# EAGLE design janaury20 (EAGLE 7.3.0)
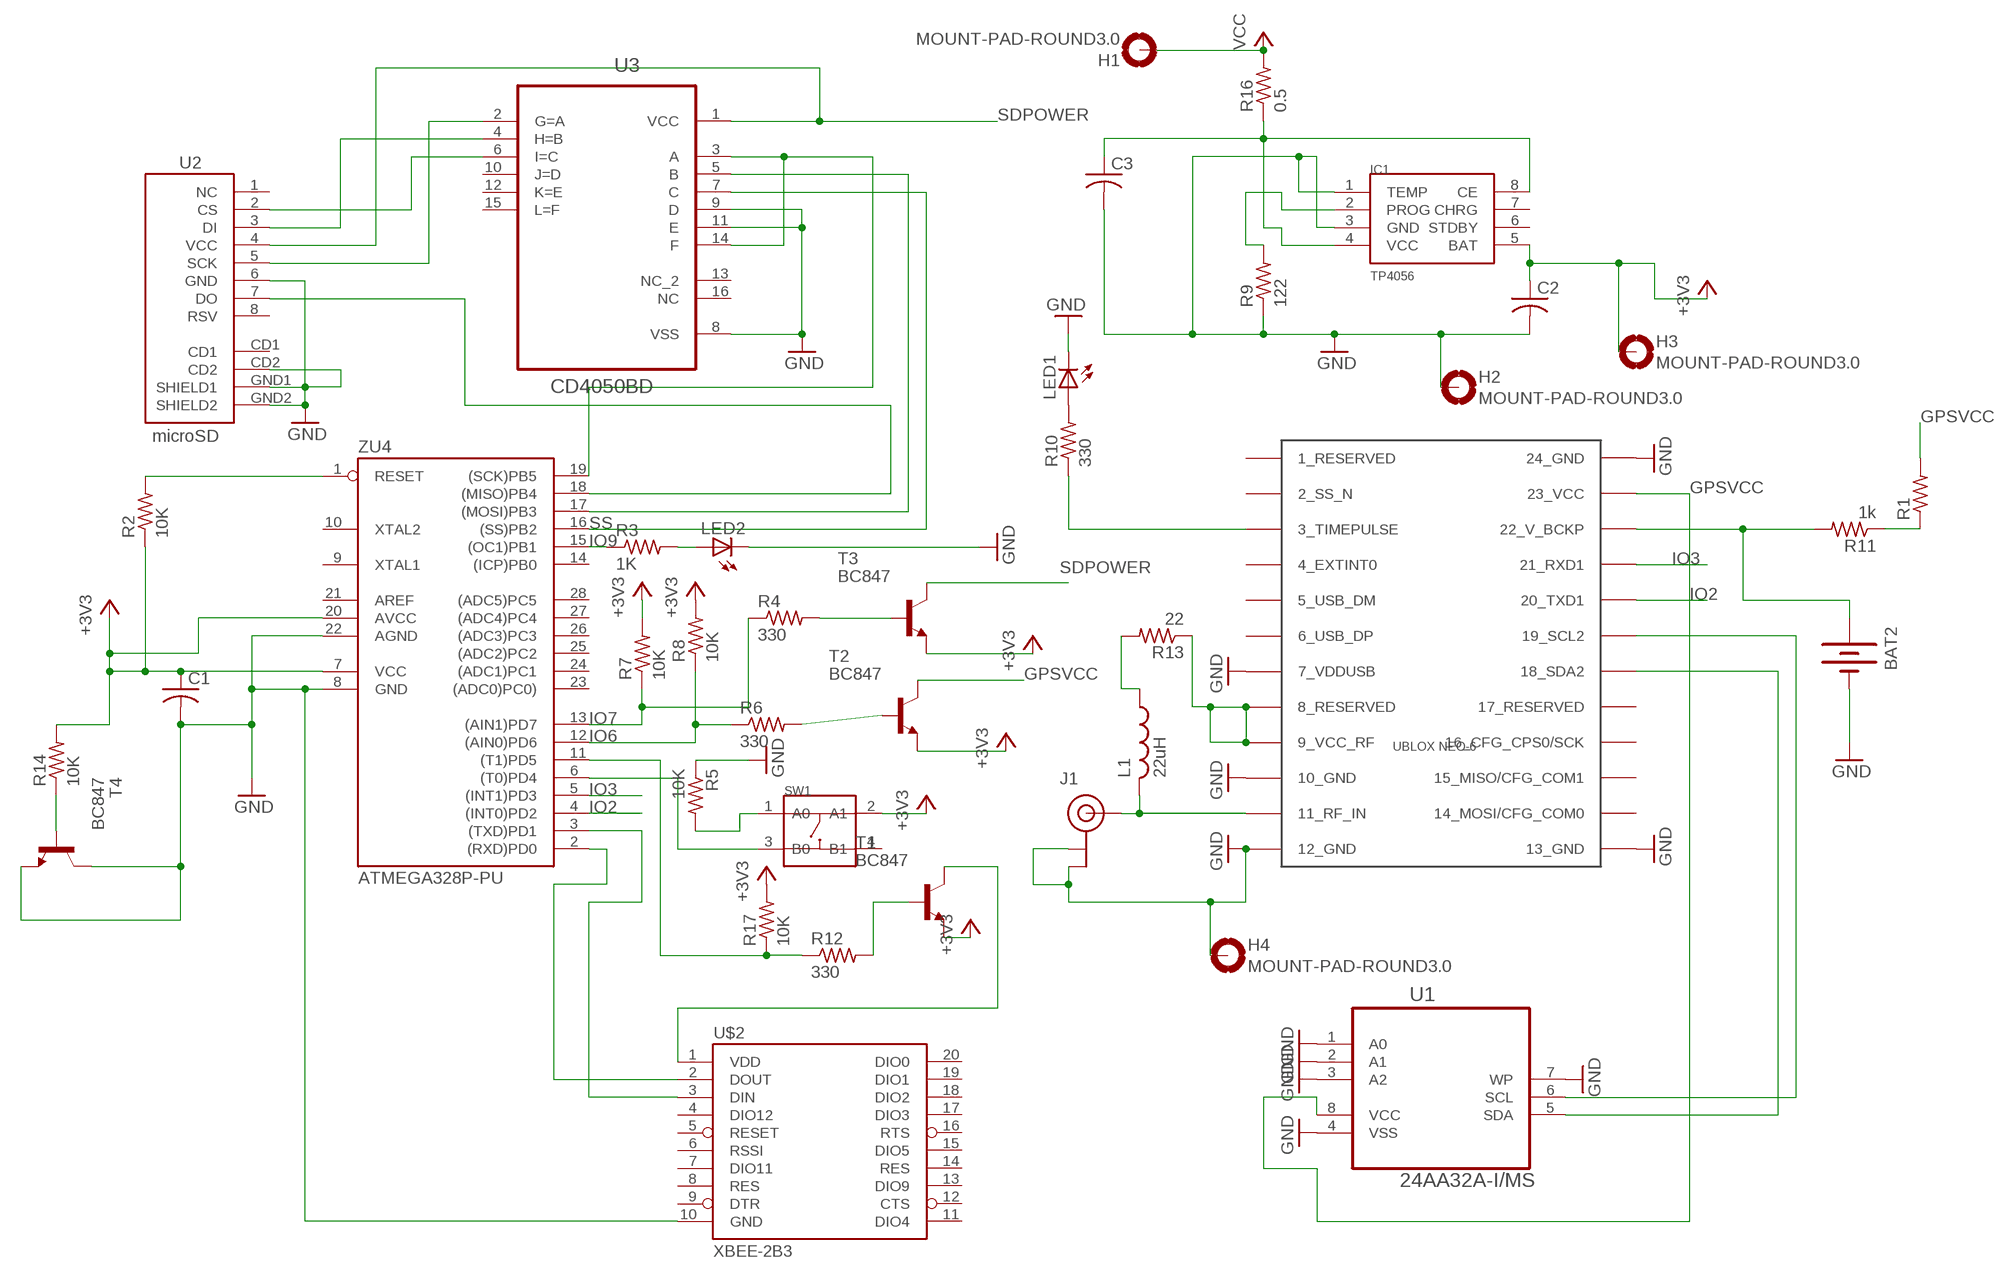
[diagram p0: schematic, sheet 1]

## Parts
BAT2  BATTERY12PTH  [BATTCON_12MM_PTH]
C1  C-USC1608  [C1608]
C2  C-USC2012  [C2012]
C3  C-USC2012  [C2012]
H1  MOUNT-PAD-ROUND3.0  [3,0-PAD]
H2  MOUNT-PAD-ROUND3.0  [3,0-PAD]
H3  MOUNT-PAD-ROUND3.0  [3,0-PAD]
H4  MOUNT-PAD-ROUND3.0  [3,0-PAD]
IC1  TP4056  [SOP-8]
J1  U.FL  [U.FL]
L1  22uH  L-USL2012C  [L2012C]
LED1  LEDSMT1206  [1206]
LED2  LEDSMT1206  [1206]
R1  R-US_R0805  [R0805]
R2  10K  R-US_M3216  [M3216]
R3  1K  R-US_M3216  [M3216]
R4  330  R-US_M3216  [M3216]
R5  10K  R-US_M3216  [M3216]
R6  330  R-US_M3216  [M3216]
R7  10K  R-US_M3216  [M3216]
R8  10K  R-US_M3216  [M3216]
R9  122  R-US_M3216  [M3216]
R10  330  R-US_M3216  [M3216]
R11  1k  R-US_M3216  [M3216]
R12  330  R-US_M3216  [M3216]
R13  22  R-US_M3216  [M3216]
R14  10K  R-US_M3216  [M3216]
R16  0.5  R-US_M2012  [M2012]
R17  10K  R-US_M3216  [M3216]
SW1  SMD-BUTTON(4P-5.2X5.2X1.5MM-SKQGAKE010)-SKQGAKE010  [SW4-SMD-5.2X5.2X1.5MM]
T1  BC847  [SOT23]
T2  BC847  [SOT23]
T3  BC847  [SOT23]
T4  BC847  [SOT23]
U1  24AA32A-I/MS  [SOP65P490X110-8N]
U2  microSD  USD-SOCKETSMD  [MICRO-SD-SOCKET-PP]
U3  CD4050BD  [SOIC127P600X175-16N]
U$1  UBLOX_NEO-6  [UBLOX_NEO-6P]
U$2  XBEE-2B3  [XBEE-SMD]
ZU4  ATMEGA328P-PU  [DIL28-3]

## Nets
+3V3 [usbvcc]: C1.1 C2.1 H3.B3,0(MOUNT) IC1.5(BAT) R2.1 R7.2 R8.2 R14.2 R17.2 SW1.2(A1) T1.2(E) T2.2(E) T3.2(E) ZU4.7(VCC) ZU4.20(AVCC)
CS: U2.2(CS) U3.6(I=C)
GND [gnd]: BAT2.GND(-) C1.2 C2.2 C3.2 H2.B3,0(MOUNT) H4.B3,0(MOUNT) IC1.1(TEMP) IC1.3(GND) J1.P$1(GND) J1.P$2(GND) LED1.C LED2.C R5.1 R9.1 T4.2(E) T4.3(C) U1.1(A0) U1.2(A1) U1.3(A2) U1.4(VSS) U1.7(WP) U2.6(GND) U2.CD2 U2.GND1(SHIELD1) U2.GND2(SHIELD2) U3.8(VSS) U3.9(D) U3.11(E) U$1.7_VDDUSB U$1.10_GND U$1.12_GND U$1.13_GND U$1.24_GND U$2.10(GND) ZU4.8(GND) ZU4.22(AGND)
GPSVCC: R1.2 T2.3(C) U1.8(VCC) U$1.23_VCC
IO2: U$1.20_TXD1 ZU4.4((INT0)PD2)
IO3: U$1.21_RXD1 ZU4.5((INT1)PD3)
IO6: R6.1 R8.1 ZU4.12((AIN0)PD6)
IO7: R4.1 R7.1 ZU4.13((AIN1)PD7)
IO9: R3.1 ZU4.15((OC1)PB1)
MOSI: U3.5(B) ZU4.17((MOSI)PB3)
N$1: U2.7(DO) ZU4.18((MISO)PB4)
N$2: LED2.A R3.2
N$3: LED1.A R10.2
N$4: R5.2 SW1.1(A0)
N$5: SW1.3(B0) ZU4.6((T0)PD4)
N$6: R4.2 T3.1(B)
N$7: R6.2 T2.1(B)
N$8: U1.6(SCL) U$1.19_SCL2
N$9: R12.1 R17.1 ZU4.11((T1)PD5)
N$10: L1.1 R13.2
N$11: U2.3(DI) U3.4(H=B)
N$12: R12.2 T1.1(B)
N$13: R13.1 U$1.8_RESERVED U$1.9_VCC_RF
N$14: R14.1 T4.1(B)
N$15: J1.P$3(SIGNAL) L1.2 U$1.11_RF_IN
N$18: BAT2.VCC@1(+) R11.2 U$1.22_V_BCKP
N$19: U1.5(SDA) U$1.18_SDA2
N$20: R1.1 R11.1
N$21: IC1.2(PROG) R9.2
N$23: U$2.2(DOUT) ZU4.2((RXD)PD0)
N$25: U$2.3(DIN) ZU4.3((TXD)PD1)
N$27: C3.1 IC1.4(VCC) IC1.8(CE) R16.1
N$28: T1.3(C) U$2.1(VDD)
RESET: R2.2 ZU4.1(RESET)
SCK: U3.3(A) U3.14(F) ZU4.19((SCK)PB5)
SCK1: U2.5(SCK) U3.2(G=A)
SCK2: R10.1 U$1.3_TIMEPULSE
SDPOWER: T3.3(C) U2.4(VCC) U3.1(VCC)
SS: U3.7(C) ZU4.16((SS)PB2)
VCC: H1.B3,0(MOUNT) R16.2
Unconnected: IC1.6(STDBY) IC1.7(CHRG) SW1.4(B1) U2.1(NC) U2.8(RSV) U2.CD1 U3.10(J=D) U3.12(K=E) U3.13(NC_2) U3.15(L=F) U3.16(NC) U$1.1_RESERVED U$1.2_SS_N U$1.4_EXTINT0 U$1.5_USB_DM U$1.6_USB_DP U$1.14_MOSI/CFG_COM0 U$1.15_MISO/CFG_COM1 U$1.16_CFG_CPS0/SCK U$1.17_RESERVED U$2.4(DIO12) U$2.5(RESET) U$2.6(RSSI) U$2.7(DIO11) U$2.8(RES) U$2.9(DTR) U$2.11(DIO4) U$2.12(CTS) U$2.13(DIO9) U$2.14(RES) U$2.15(DIO5) U$2.16(RTS) U$2.17(DIO3) U$2.18(DIO2) U$2.19(DIO1) U$2.20(DIO0) ZU4.9(XTAL1) ZU4.10(XTAL2) ZU4.14((ICP)PB0) ZU4.21(AREF) ZU4.23((ADC0)PC0)) ZU4.24((ADC1)PC1) ZU4.25((ADC2)PC2) ZU4.26((ADC3)PC3) ZU4.27((ADC4)PC4) ZU4.28((ADC5)PC5)

## Library data of the parts
BAT2 = SparkFun-Electromechanical:BATTERY: Battery Holders Various common sizes : AA, AAA, 18650 (PRT-12895), 20mm coin cell and 12mm coin cell. 20MM_4LEGS, BATT-10373; PROD_ID: BATT-08315
C1-C3 = resistor:C-US: CAPACITOR, American symbol
H1-H4 = holes:MOUNT-PAD-ROUND: MOUNTING PAD, round
IC1 = TP4056:TP4056
J1 = SparkFun-Connectors:U.FL: SMD antenna connector- WRL-09144; PROD_ID: CONN-09193
L1 = resistor:L-US: INDUCTOR, American symbol
LED1 LED2 = led:LED: LED OSRAM: - CHIPLED LG R971, LG N971, LY N971, LG Q971, LY Q971, LO R971, LY R971 LH N974, LH R974 LS Q976, LO Q976, LY Q976 LO Q996 - Hyper CHIPLED LW Q18S LB Q993, LB Q99A, LB R99A - SideLED LS A670, LO A670, LY A670, LG A670, LP A670 LB A673, LV A673, LT A673, LW A673 LH A674 LY A675 LS A676, LA A676, LO A676, LY A676, LW A676 LS A679, LY A679, LG A679 - Hyper Micro SIDELED® LS Y876, LA Y876, LO Y876, LY Y876 LT Y87S - SmartLED LW L88C, LW L88S LB L89C, LB L89S, LG L890 LS L89K, LO L89K, LY L89K LS L896, LA L896, LO L896, LY L896 - TOPLED LS T670, LO T670, LY T670, LG T670, LP T670 LSG T670, LSP T670, LSY T670, LOP T670, LYG T670 LG T671, LOG T671, LSG T671 LB T673, LV T673, LT T673, LW T673 LH T674 LS T676, LA T676, LO T676, LY T676, LB T676, LH T676, LSB T676, LW T676 LB T67C, LV T67C, LT T67C, LS T67K, LO T67K, LY T67K, LW E67C LS E67B, LA E67B, LO E67B, LY E67B, LB E67C, LV E67C, LT E67C LW T67C LS T679, LY T679, LG T679 LS T770, LO T770, LY T770, LG T770, LP T770 LB T773, LV T773, LT T773, LW T773 LH T774 LS E675, LA E675, LY E675, LS T675 LS T776, LA T776, LO T776, LY T776, LB T776 LHGB T686 LT T68C, LB T68C - Hyper Mini TOPLED® LB M676 - Mini TOPLED Santana® LG M470 LS M47K, LO M47K, LY M47K Source: http://www.osram.convergy.de LUXEON: - LUMILED® LXK2-PW12-R00, LXK2-PW12-S00, LXK2-PW14-U00, LXK2-PW14-V00 LXK2-PM12-R00, LXK2-PM12-S00, LXK2-PM14-U00 LXK2-PE12-Q00, LXK2-PE12-R00, LXK2-PE12-S00, LXK2-PE14-T00, LXK2-PE14-U00 LXK2-PB12-K00, LXK2-PB12-L00, LXK2-PB12-M00, LXK2-PB14-N00, LXK2-PB14-P00, LXK2-PB14-Q00 LXK2-PR12-L00, LXK2-PR12-M00, LXK2-PR14-Q00, LXK2-PR14-R00 LXK2-PD12-Q00, LXK2-PD12-R00, LXK2-PD12-S00 LXK2-PH12-R00, LXK2-PH12-S00 LXK2-PL12-P00, LXK2-PL12-Q00, LXK2-PL12-R00 Source: www.luxeon.com KINGBRIGHT: KA-3528ASYC Source: www.kingbright.com
R1-R14 R16 R17 = resistor:R-US_: RESISTOR, American symbol
SW1 = Seeed-OPL-Switch:SMD-BUTTON(4P-5.2X5.2X1.5MM-SKQGAKE010): 311020067
T1-T4 = transistor:BC847: NPN TRANSISTOR
U1 = Microchip_By_element14_Batch_2:24AA32A-I/MS: IC EEPROM 32KBIT 400KHZ; MPN: 24AA32A-I/MS; OC_FARNELL: 1331296; OC_NEWARK: 40C2562; PACKAGE: MSOP8; SUPPLIER: Microchip
U2 = SparkFun:USD-SOCKET: microSD Socket Push-push type uSD socket. Schematic element and footprint production proven. Spark Fun Electronics SKU : PRT-00127. tDoc lines correctly indicate media card edge positions when inserting (unlocked, locked, depressed).
U3 = Texas Instruments_By_element14_Batch_1:CD4050BD: CMOS Hex Buffer/Converters; MPN: CD4050BD; OC_FARNELL: 1740857; OC_NEWARK: 50R5062; PACKAGE: 16-SOIC; SUPPLIER: Texas Instruments
U$1 = Ava:UBLOX_NEO-6: UBLOX NEO-6 GPS MODULE Author Anthony Stirk / http://ava.upuaut.net http://www.u-blox.com/images/downloads/Product_Docs/LEA-6_NEO-6_MAX_HardwareIntegrationManual_%28GPS.G6-HW-09007%29.pdf http://www.u-blox.com/images/downloads/Product_Docs/NEO-6_DataSheet_%28GPS.G6-HW-09005%29.pdf
U$2 = SparkFun-RF:XBEE-2: Xbee module footprints SMT header is CONN-09042.; PROD_ID: CONN-09042
ZU4 = SmartPrj:ATMEGA328P-: MICROCONTROLLER 4 Kbytes FLASH 128 bytes SRAM 256 bytes EEPROM UART 6-channel 10 bit ADC

## Net classes
2 gnd: width 0.305 mm, drill 0.559 mm, clearance 0.254 mm
3 usbvcc: width 0.508 mm, drill 0.61 mm, clearance 0.254 mm

## Board
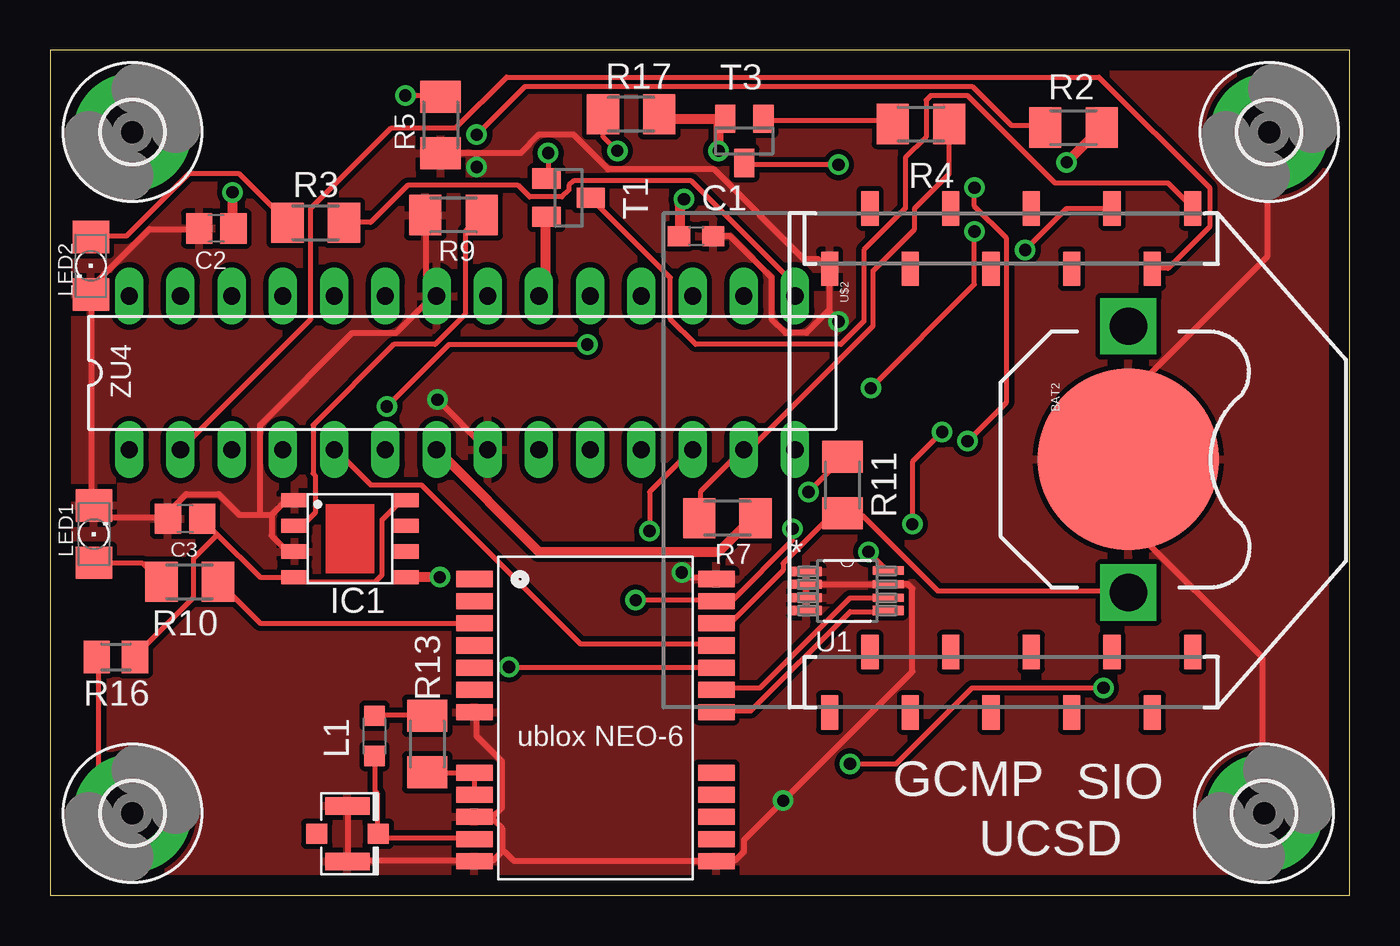
[diagram p1: board, top side]
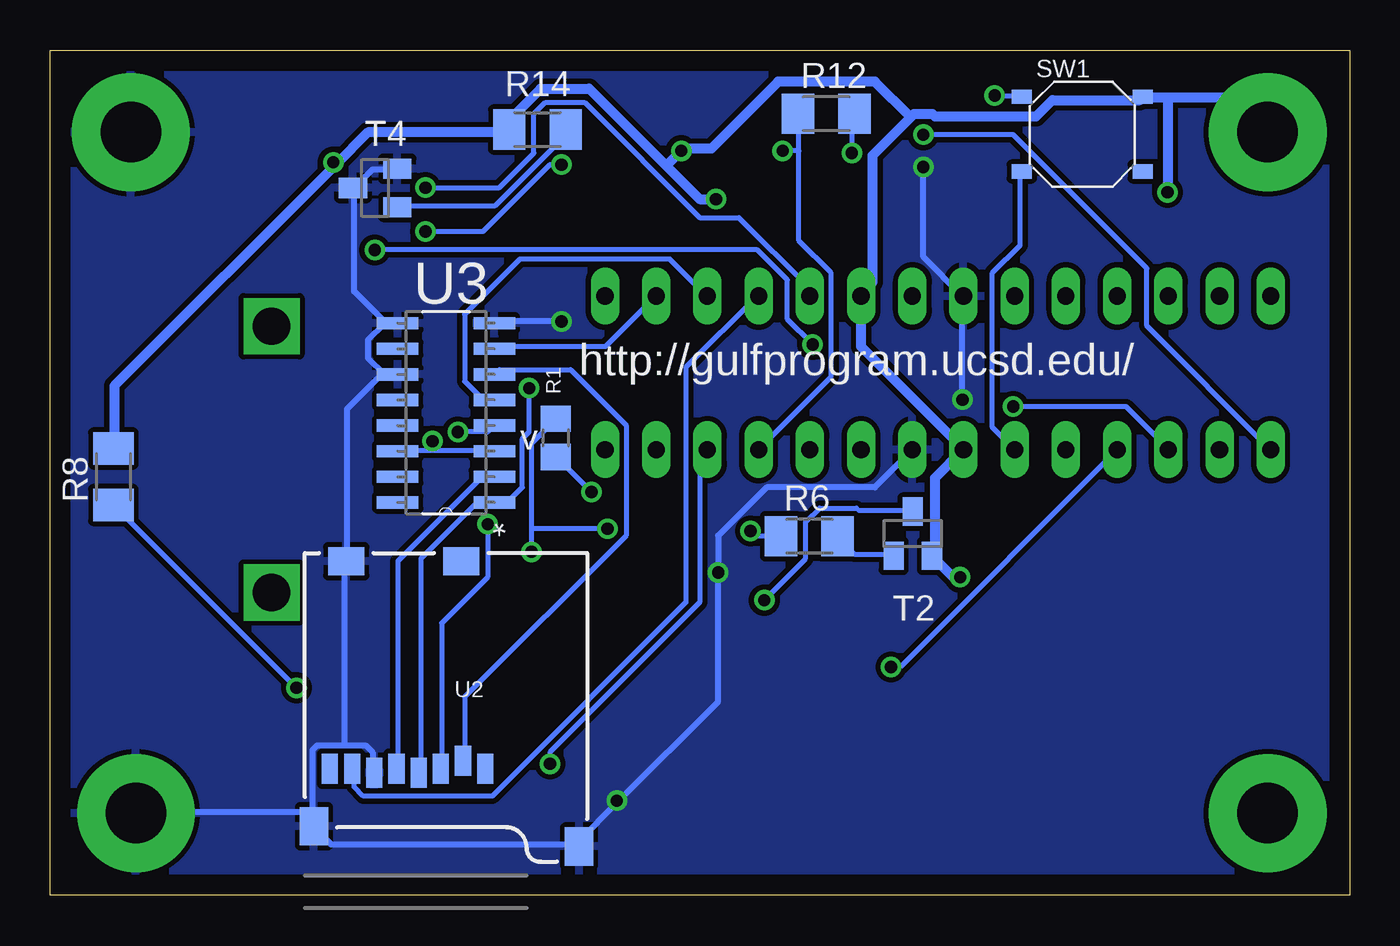
[diagram p2: board, bottom side, seen from below]

Size 64.44 x 41.9 mm. Coordinates in mm from the lower left corner, seen from the top.
Outline: 0,0 64.44,0 64.44,41.9 0,41.9 0,0
Copper layers (1*16): Top 0.035mm / dielectric 1.5mm / Bottom 0.035mm
Design rules "default": minimum track width 10mil, minimum drill 24mil, track to track 8mil, track to pad 8mil, pad to pad 8mil, via to via 8mil, smd to smd 8mil, copper to edge 40mil, drill to drill 8mil, minimum pad ring 10mil, minimum via ring 8mil, stop-mask expansion 4mil, vias tented up to drill 0mil, thermal gap 10mil

### Footprints (pad centres in the part's own frame; a part is rotated, then mirrored left to right if it is on the bottom)
BATTCON_12MM_PTH = smd 9 x 9: GND 0,0 | drill 1.854 square: VCC@1 6.604,0; VCC@2 -6.604,0
C1608 = smd 1.1 x 1: 1 -0.85,0; 2 0.85,0
C2012 = smd 1.3 x 1.5: 1 -0.85,0; 2 0.85,0
3,0-PAD = drill 3 pad 5.842: B3,0 0,0
SOP-8 = smd 1.3 x 0.7: 1 -2.75,1.905; 2 -2.75,0.635; 3 -2.75,-0.635; 4 -2.75,-1.905; 5 2.75,-1.905; 6 2.75,-0.635; 7 2.75,0.635; 8 2.75,1.905
U.FL = smd 2.2 x 0.85: P$1 0,1.375; P$2 0,-1.375 | smd 1.05 x 1: P$3 1.525,0; P$4 -1.525,0
L2012C = smd 1 x 1: 1 -1,0; 2 1,0
1206 = smd 1.6 x 1.803: A -1.422,0; C 1.422,0
R0805 = smd 1.3 x 1.5: 1 -0.95,0; 2 0.95,0
M3216 = smd 1.6 x 2: 1 -1.4,0; 2 1.4,0
M2012 = smd 1.3 x 1.6: 1 -0.95,0; 2 0.95,0
SW4-SMD-5.2X5.2X1.5MM = smd 1 x 0.7: 1 -3,1.85; 2 3,1.85; 3 -3,-1.85; 4 3,-1.85
SOT23 = smd 1 x 1.4: 1 -0.95,-1.1; 2 0.95,-1.1; 3 0,1.1
SOP65P490X110-8N = smd 1.524 x 0.457: 1 -2.032,0.965; 2 -2.032,0.33; 3 -2.032,-0.33; 4 -2.032,-0.965; 5 2.032,-0.965 | smd 1.524 x 0.406: 6 2.032,-0.33; 7 2.032,0.33; 8 2.032,1.016
MICRO-SD-SOCKET-PP = smd 0.8 x 1.5: 1 -8.94,10.7; 2 -7.84,10.3; 3 -6.74,10.7; 4 -5.64,10.9; 5 -4.54,10.7; 6 -3.44,10.9; 7 -2.34,10.7; 8 -1.24,10.7 | smd 1.8 x 1.4: CD1 -7.75,0.4; CD2 -2.05,0.4 | smd 1.4 x 1.9: GND1 -13.6,14.55; GND2 -0.45,13.55
SOIC127P600X175-16N = smd 2.057 x 0.61: 1 -4.801,8.89; 2 -4.801,7.62; 3 -4.801,6.35; 4 -4.801,5.08; 5 -4.801,3.81; 6 -4.801,2.54; 7 -4.801,1.27; 8 -4.801,0; 9 0,0; 10 0,1.27; 11 0,2.54; 12 0,3.81; 13 0,5.08; 14 0,6.35; 15 0,7.62; 16 0,8.89
UBLOX_NEO-6P = smd 1.8 x 0.8: 1_RESERVED 6.4,-7.4; 2_SS_N 6.4,-6.3; 3_TIMEPULSE 6.4,-5.2; 4_EXTINT0 6.4,-4.1; 5_USB_DM 6.4,-3; 6_USB_DP 6.4,-1.9; 7_VDDUSB 6.4,-0.8; 8_RESERVED 6.4,2.2; 9_VCC_RF 6.4,3.3; 10_GND 6.4,4.4; 11_RF_IN 6.4,5.5; 12_GND 6.4,6.6; 13_GND -5.6,6.6; 14_MOSI/CFG_COM0 -5.6,5.5; 15_MISO/CFG_COM1 -5.6,4.4; 16_CFG_CPS0/SCK -5.6,3.3; 17_RESERVED -5.6,2.2; 18_SDA2 -5.6,-0.8; 19_SCL2 -5.6,-1.9; 20_TXD1 -5.6,-3; 21_RXD1 -5.6,-4.1; 22_V_BCKP -5.6,-5.2; 23_VCC -5.6,-6.3; 24_GND -5.6,-7.4
XBEE-SMD = smd 1.7 x 0.85: 1 -12.5,20; 2 -9.5,18; 3 -12.5,16; 4 -9.5,14; 5 -12.5,12; 6 -9.5,10; 7 -12.5,8; 8 -9.5,6; 9 -12.5,4; 10 -9.5,2; 11 12.5,2; 12 9.5,4; 13 12.5,6; 14 9.5,8; 15 12.5,10; 16 9.5,12; 17 12.5,14; 18 9.5,16; 19 12.5,18; 20 9.5,20
DIL28-3 = drill 0.85 pad 1.422 long: 1 -16.51,-3.81; 2 -13.97,-3.81; 3 -11.43,-3.81; 4 -8.89,-3.81; 5 -6.35,-3.81; 6 -3.81,-3.81; 7 -1.27,-3.81; 8 1.27,-3.81; 9 3.81,-3.81; 10 6.35,-3.81; 11 8.89,-3.81; 12 11.43,-3.81; 13 13.97,-3.81; 14 16.51,-3.81; 15 16.51,3.81; 16 13.97,3.81; 17 11.43,3.81; 18 8.89,3.81; 19 6.35,3.81; 20 3.81,3.81; 21 1.27,3.81; 22 -1.27,3.81; 23 -3.81,3.81; 24 -6.35,3.81; 25 -8.89,3.81; 26 -11.43,3.81; 27 -13.97,3.81; 28 -16.51,3.81

### Placement (x,y rotation side)
BAT2  53.47,21.62 270 top
C1  32.03,32.69 0 top
C2  8.23,33.07 180 top
C3  6.68,18.67 180 top
H1  4.06,4.06 0 top
H2  60.2,4.06 0 top
H3  4.06,37.85 0 top
H4  60.45,37.85 0 top
IC1  14.86,17.68 0 top
J1  14.73,3.05 0 top
L1  16.08,7.9 270 top
LED1  2.16,17.91 90 top
LED2  2.01,31.22 270 top
R1  39.37,22.68 90 bottom
R2  50.75,38.07 180 top
R3  13.16,33.35 180 top
R4  43.18,38.25 180 top
R5  19.35,38.2 90 top
R6  26.8,17.81 0 bottom
R7  33.58,18.69 0 top
R8  61.32,20.75 90 bottom
R9  19.99,33.73 0 top
R10  6.91,15.54 180 top
R11  39.29,20.35 270 top
R12  25.96,38.76 0 bottom
R13  18.69,7.49 90 top
R14  40.28,37.97 180 bottom
R16  3.25,11.81 180 top
R17  28.8,38.73 0 top
SW1  13.26,37.74 0 bottom
T1  25.7,34.59 270 top
T2  21.67,17.93 0 bottom
T3  34.42,37.41 180 top
T4  48.34,35.08 90 bottom
U1  39.52,15.09 0 top
U2  51.82,16.97 180 bottom
U3  47.22,28.37 180 bottom
U$1  27.43,8.28 180 top
U$2  36.65,21.56 270 top
ZU4  20.42,25.91 0 top

### Tracks (layer width: path | path; a pad name or v marks a point on that pad's centre or on a via)
+3V3  (via drill 0.61)
  Top 0.508: R17.2 30.29,38.63 30.4,38.52 33.38,38.52 T3.2 33.15,38.29 v33.15,36.92 | v31.43,34.52 31.2,34.29 31.2,32.69 C1.1 | v50.41,36.35 52.12,38.06 R2.1 | v9.03,34.86 9.03,33.15 C2.1 | ZU4.20 24.57,30.06 24.57,33.6 T1.2 | v19.32,15.77 IC1.5 | R7.2 34.98,18.63 34.75,18.63 33.15,17.03 24.23,17.03 19.2,22.06 ZU4.7
  Bottom 0.508: v31.43,34.52 32.23,34.52 33.89,36.18 | 33.89,36.18 37.72,40.01 40.12,40.01 41.6,38.52 41.6,38.06 R14.2 41.83,37.83 48.69,37.83 50.29,36.23 | 50.29,36.23 61.27,25.26 61.27,22.17 R8.2 | v50.41,36.35 50.29,36.23 | 33.89,36.18 v33.15,36.92 32.92,37.03 31.66,37.03 28.35,40.35 23.55,40.35 21.77,38.58 | 9.03,39.55 5.71,39.55 4.12,37.95 H3.B3,0 | 9.03,39.55 10.17,39.55 SW1.2 10.4,39.43 14.74,39.43 15.54,38.63 20.57,38.63 20.69,38.75 21.6,38.75 21.77,38.58 | 9.03,39.55 v9.03,34.86 | v19.32,15.77 19.66,15.77 20.69,16.8 T2.2 20.57,17.03 20.57,20.69 19.2,22.06 ZU4.7 19.32,22.29 24.23,27.2 ZU4.20 24.12,29.95 23.66,30.4 23.66,36.69 21.77,38.58
CS
  Bottom 0.254: U2.2 43.89,6.74 43.89,9.83 35.89,17.83 35.89,23.32 38.63,26.06 42.18,26.06 42.41,25.83 U3.6
GND  (via drill 0.61)
  Top 0.305: C1.2 33.72,32.69 35.78,30.63 35.78,28.57 36.46,27.89 37.49,27.89 38.58,28.98 | 38.58,28.98 38.63,29.03 38.63,30.98 U$2.10 38.52,31.09 38.06,31.55 37.38,31.55 32.92,36.01 27.66,36.01 25.95,37.72 24.23,37.72 23.32,36.8 21.14,36.8 | 21.14,36.8 19.43,36.8 R5.1 | 38.58,28.98 v39.09,28.46 | C2.2 7.32,33.03 4.92,33.03 2.06,30.18 2.06,29.83 LED2.C 2.06,29.72 2.06,19.43 LED1.C 2.17,19.32 2.74,18.75 5.83,18.75 C3.2 5.71,18.86 6.74,19.89 8.34,19.89 9.37,18.86 10.4,18.86 | R9.1 18.63,33.72 18.63,30.18 19.09,29.72 ZU4.22 18.97,29.72 17.14,27.89 14.97,27.89 10.4,23.32 10.4,18.86 | 10.97,18.86 10.97,17.83 11.66,17.14 12,17.14 IC1.3 | 10.97,18.86 11.66,19.55 12,19.55 IC1.1 | 10.4,18.86 10.97,18.86 | v21.14,36.12 21.14,36.8 | H4.B3,0 60.35,37.83 60.35,31.66 53.49,24.8 53.49,21.72 BAT2.GND 53.49,21.49 53.49,18.4 60.12,11.77 60.12,4.12 H2.B3,0 | U1.4 U1.3 U1.2 | U1.2 U1.1 | U1.2 37.6,15.43 41.49,15.43 U1.7 41.6,15.43 42.52,15.43 42.75,15.2 42.75,11.09 v36.35,4.69 34.4,2.74 34.4,2.17 33.95,1.71 33.15,1.71 U$1.13_GND 32.92,1.71 22.97,1.71 22.52,2.17 22.4,2.17 | J1.P$1 14.74,4.34 14.74,1.71 J1.P$2 14.86,1.71 20.92,1.71 U$1.12_GND 21.14,1.71 21.95,1.71 22.4,2.17 | 22.4,2.17 22.4,3.31 21.95,3.77 | 21.95,3.77 21.14,3.77 U$1.10_GND | U$1.7_VDDUSB 21.14,9.03 21.14,7.89 22.4,6.63 22.4,4.34 21.95,3.89 21.95,3.77 | v31.32,16 31.55,15.77 32.92,15.77 U$1.24_GND | v19.2,24.57 21.6,22.17 ZU4.8
  Bottom 0.305: v39.09,28.46 42.41,28.46 U3.8 | v21.14,36.12 21.14,31.66 19.2,29.72 ZU4.22 19.2,29.6 v19.2,24.57 | ZU4.8 21.72,22.06 23.55,20.23 28.92,20.23 31.32,17.83 v31.32,16 31.32,9.6 36.29,4.63 | T4.2 47.32,36.01 48.46,36.01 49.38,35.09 T4.3 49.38,34.98 49.38,29.95 47.89,28.46 U3.9 47.32,28.35 47.89,28.35 48.69,27.55 48.69,26.63 47.89,25.83 U3.11 48.01,25.83 49.72,24.12 49.72,16.69 U2.CD2 49.84,16.46 49.84,7.43 | 49.84,7.43 51.21,7.43 51.44,7.2 51.44,3.43 U2.GND2 | 49.84,7.43 48.81,7.43 48.46,7.09 48.46,6.17 U2.6 | U2.GND2 51.32,3.31 50.52,2.52 38.29,2.52 U2.GND1 38.29,2.63 36.29,4.63 | H2.B3,0 60.12,4.12 51.55,4.12 U2.GND2 | v36.35,4.69 36.29,4.63
  pour Top: 0,41.91 64.77,41.91 64.77,0 0,0
  pour Bottom: 0,41.91 64.77,41.91 64.77,0 0,0 0,1.27
GPSVCC  (via drill 0.61)
  Top 0.254: v40.58,17.03 41.49,16.12 U1.8 | v29.03,14.63 32.92,14.63 U$1.23_VCC 33.15,14.63 33.83,14.63 36.8,17.6 v36.8,18.17
  Bottom 0.254: v40.58,17.03 40.58,18.17 | 40.58,18.17 40.58,22.4 39.43,23.55 R1.2 | v29.03,14.63 26.98,16.69 26.98,18.52 26.29,19.2 24.46,19.2 24.35,19.09 21.72,19.09 T2.3 | v36.8,18.17 40.58,18.17
IO2  (via drill 0.61)
  Top 0.254: v22.75,11.32 32.92,11.32 U$1.20_TXD1
  Bottom 0.254: v22.75,11.32 22.29,11.32 11.54,22.06 ZU4.4
IO3
  Top 0.254: U$1.21_RXD1 32.92,12.46 26.29,12.46 18.4,20.34 15.89,20.34 14.17,22.06 ZU4.5
IO6  (via drill 0.61)
  Top 0.254: v29.72,18.06 29.72,20 31.77,22.06 ZU4.12 | v52.23,10.29 45.72,10.29 41.95,6.51 v39.66,6.51
  Bottom 0.254: v29.72,18.06 29.49,17.83 28.23,17.83 R6.1 | v52.23,10.29 61.27,19.32 R8.1 | v39.66,6.51 39.66,7.09 32.23,14.52 32.23,21.72 ZU4.12
IO7
  Top 0.254: R7.1 32.23,18.75 32.23,20 34.29,22.06 ZU4.13 34.4,22.17 34.75,22.17 40.8,28.23 40.8,30.98 42.86,33.03 42.86,34.06 44.58,35.78 44.58,38.18 R4.1
IO9
  Top 0.254: R3.1 14.63,33.38 15.89,33.38 17.72,35.2 23.2,35.2 23.77,34.63 25.38,34.63 25.72,34.98 25.72,35.2 25.95,35.43 31.77,35.43 36.92,30.29 36.92,29.72 ZU4.15
MOSI
  Bottom 0.254: U3.5 42.52,24.57 42.98,24.57 43.89,25.49 43.89,28.8 41.15,31.55 33.72,31.55 31.89,29.72 ZU4.17
N$1
  Bottom 0.254: U2.7 49.38,6.17 49.38,5.37 48.92,4.92 42.52,4.92 32.92,14.52 32.92,26.18 29.38,29.72 ZU4.18
N$2
  Top 0.254: LED2.A 2.06,32.69 3.77,32.69 6.86,35.78 9.37,35.78 11.77,33.38 R3.2
N$3
  Top 0.254: LED1.A 2.17,16.46 4.57,16.46 5.49,15.54 R10.2
N$4  (via drill 0.61)
  Top 0.254: v17.6,39.66 19.32,39.66 R5.2
  Bottom 0.254: v17.6,39.66 16.34,39.66 SW1.1
N$5
  Bottom 0.254: ZU4.6 17.72,23.2 17.72,30.86 16.34,32.23 16.34,35.89 SW1.3
N$6
  Top 0.254: T3.1 35.43,38.41 41.6,38.41 41.72,38.29 R4.2
N$7
  Bottom 0.254: T2.1 22.63,16.92 24.57,16.92 25.38,17.72 R6.2
N$8
  Top 0.254: U1.6 41.49,14.74 39.66,14.74 35.2,10.29 33.03,10.29 U$1.19_SCL2
N$9  (via drill 0.61)
  Top 0.254: v28.12,36.92 27.43,37.6 27.43,38.63 R17.1
  Bottom 0.254: 27.32,36.92 27.32,32.46 25.72,30.86 25.72,25.72 29.26,22.17 ZU4.11 | 27.32,36.92 27.32,38.75 R12.1 | 27.32,36.92 v28.12,36.92
N$10
  Top 0.254: L1.1 16.12,8.91 18.63,8.91 R13.2
N$11  (via drill 0.61)
  Top 0.254: v42.75,18.4 42.75,21.49 v44.23,22.97
  Bottom 0.254: v42.75,18.4 42.75,15.77 45.03,13.49 45.03,6.29 U2.3 | v44.23,22.97 42.75,22.97 42.52,23.2 U3.4
N$12  (via drill 0.61)
  Top 0.254: v24.69,36.8 24.69,35.55 T1.1
  Bottom 0.254: v24.69,36.8 24.69,38.63 24.57,38.75 R12.2
N$13
  Top 0.254: U$1.9_VCC_RF 21.03,5.03 21.03,6.06 U$1.8_RESERVED 20.92,6.06 18.75,6.06 R13.1
N$14
  Bottom 0.254: T4.1 47.21,34.18 42.41,34.18 38.98,37.6 38.98,37.95 R14.1
N$15
  Top 0.254: L1.2 16.12,6.86 16.12,5.14 16.23,5.03 16.23,3.09 J1.P$3 16.34,2.97 16.46,2.86 21.03,2.86 U$1.11_RF_IN
N$18
  Top 0.254: U$1.22_V_BCKP 33.72,13.49 36.35,16.12 36.35,16.46 38.75,18.86 39.2,18.86 R11.2 39.32,18.86 40.23,18.86 44.01,15.09 53.38,15.09 BAT2.VCC@1
N$19
  Top 0.254: U1.5 41.49,14.06 39.66,14.06 34.75,9.14 33.03,9.14 U$1.18_SDA2
N$20  (via drill 0.61)
  Top 0.254: v37.6,20 39.32,21.72 R11.1
  Bottom 0.254: v37.6,20 39.32,21.72 R1.1
N$21
  Top 0.254: IC1.2 12.12,18.4 12.57,18.4 13.14,18.97 13.14,20.8 13.03,20.92 13.03,23.32 17.03,27.32 19.09,27.32 20.57,28.8 20.57,32.92 21.37,33.72 R9.2
N$23
  Top 0.254: U$2.2 54.75,31.09 55.44,31.09 57.49,33.15 57.49,35.09 52.01,40.58 22.63,40.58 20.12,38.06 16.92,38.06 12.92,34.06 12.92,28.57 6.51,22.17 ZU4.2
N$25  (via drill 0.61)
  Top 0.254: v48.35,32 50.41,34.06 52.58,34.06 U$2.3 | v26.63,27.32 19.77,27.32 v16.69,24.23
  Bottom 0.254: v48.35,32 29.38,32 27.89,30.52 27.89,28.57 v26.63,27.32 | v16.69,24.23 11.09,24.23 9.03,22.17 ZU4.3
N$27
  Top 0.254: 8.29,17.89 7.54,18.63 C3.1 | 8.29,17.89 10.4,15.77 IC1.4 12.23,15.77 12.46,15.54 16.12,15.54 16.46,15.89 16.46,18.63 17.37,19.55 17.6,19.55 IC1.8 | 8.29,17.89 7.09,16.69 7.09,14.74 4.23,11.89 R16.1
N$28
  Top 0.254: T1.3 26.86,34.52 30.75,30.63 30.75,28.57 32,27.32 39.2,27.32 40.35,28.46 40.35,32 42.41,34.06 42.41,36.58 43.43,37.6 43.43,39.43 43.66,39.66 45.49,39.66 49.84,35.32 55.44,35.32 56.58,34.18 U$2.1
RESET  (via drill 0.61)
  Top 0.254: v21.14,37.72 23.55,40.12 45.72,40.12 47.66,38.18 49.26,38.18 R2.2
  Bottom 0.254: v21.14,37.72 16.69,37.72 10.06,31.09 10.06,28.23 4,22.17 ZU4.1
SCK  (via drill 0.61)
  Top 0.254: v45.83,35.09 45.83,34.18 47.43,32.58 47.43,24.46 v45.49,22.52
  Bottom 0.254: 45.49,22.06 47.21,22.06 U3.14 | 45.49,22.06 42.52,22.06 U3.3 | v45.83,35.09 42.18,35.09 40.46,36.8 40.46,38.75 39.89,39.32 37.95,39.32 32.23,33.6 30.29,33.6 26.86,30.18 26.86,29.72 ZU4.19 | 45.49,22.06 v45.49,22.52
SCK1
  Bottom 0.254: U2.5 47.21,6.29 47.21,16.57 43.09,20.69 42.52,20.69 U3.2
SCK2
  Top 0.254: U$1.3_TIMEPULSE 10.4,13.49 8.34,15.54 R10.1
SDPOWER  (via drill 0.61)
  Top 0.254: v39.09,36.23 34.52,36.23 T3.3 | v45.83,32.92 45.83,30.29 v40.69,25.15
  Bottom 0.254: v39.09,36.23 39.66,36.23 42.98,32.92 v45.83,32.92 | v40.69,25.15 40.69,22.97 41.03,22.63 41.03,20.23 41.72,19.55 42.41,19.55 U3.1 42.52,19.43 43.32,19.43 46.06,16.69 46.06,6.17 U2.4
SS
  Bottom 0.254: U3.7 42.41,27.2 36.92,27.2 34.4,29.72 ZU4.16
VCC
  Top 0.254: R16.2 2.4,11.77 2.4,5.71 4,4.12 H1.B3,0

### Text on the board
tNames: GCMP | SIO | UCSD
bNames: http://gulfprogram.ucsd.edu/ | v